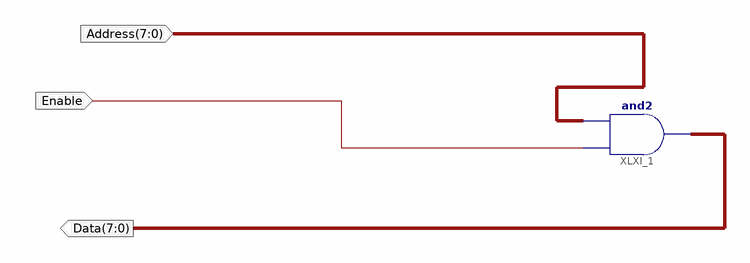
[diagram p0: schematic sheet 1]
// Xilinx ISE schematic C5_4_0.sch (kintex7) as structural Verilog: 1 symbols, 3 ports
module C5_4_0 (
  input  [7:0] Address,
  input  Enable,
  output [7:0] Data
);

  assign Data = {8{Enable}} & Address;  // and2 XLXI_1, 8 bits wide
endmodule
